# EAGLE design ATTinyRec (EAGLE 7.1.0)
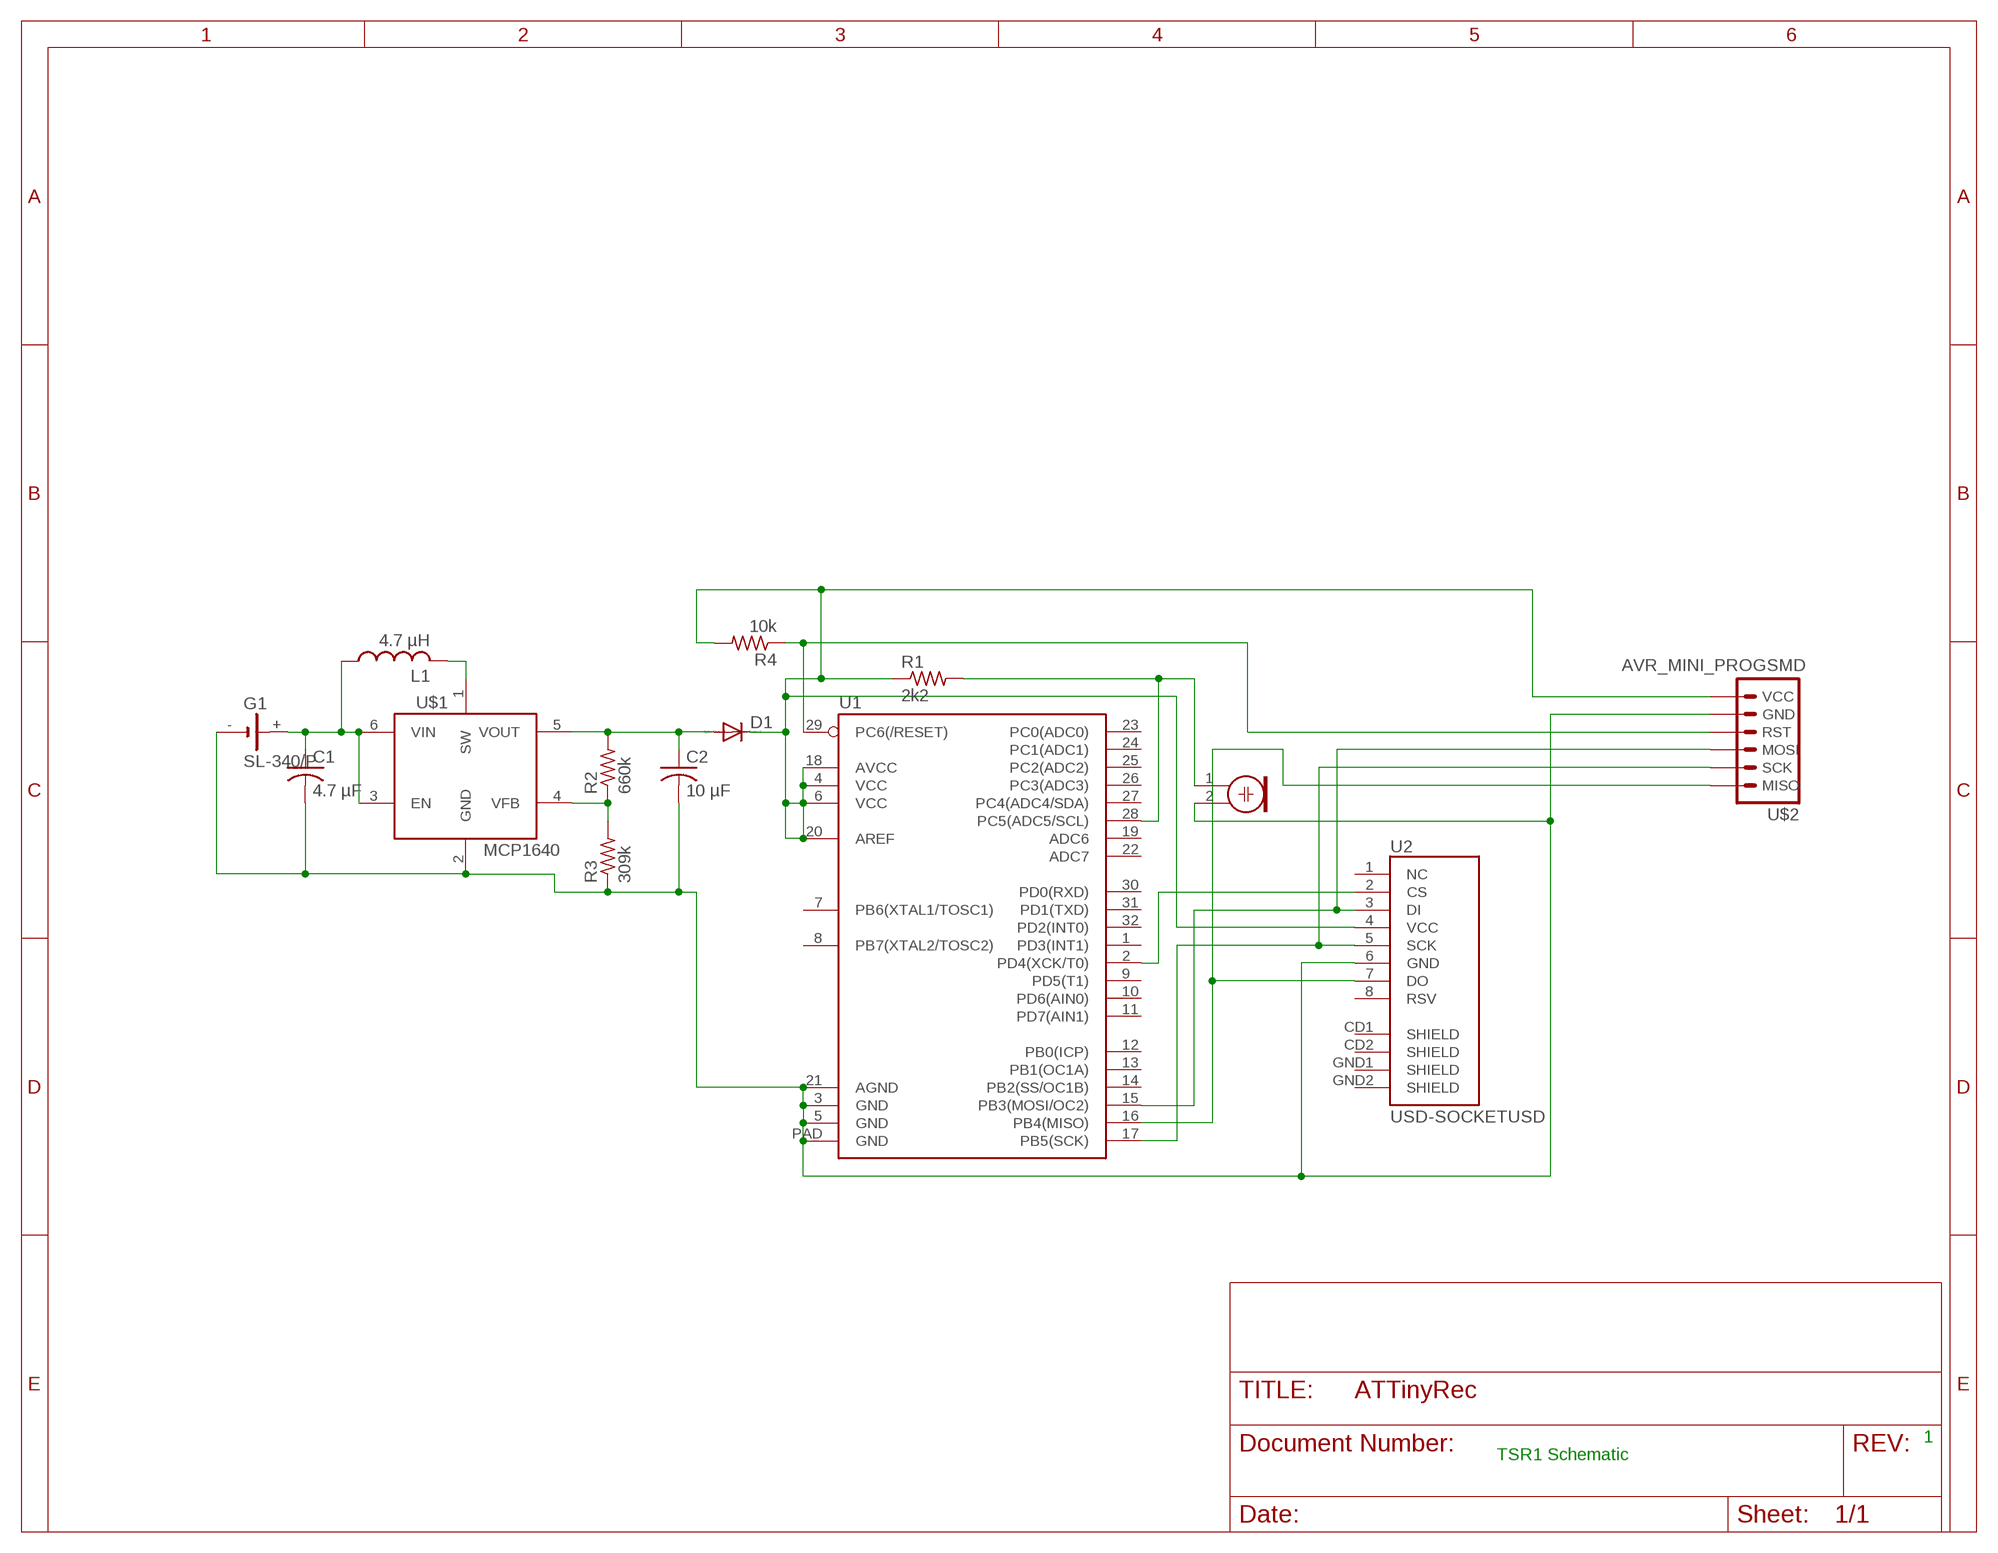
[diagram p0: schematic, sheet 1]

## Parts
C1  4.7 µF  C-USC0402  [C0402]
C2  10 µF  C-USC0402  [C0402]
D1  DIODE-DO214AC  [DO214AC]
G1  SL-340/P  [BEL/P]
L1  4.7 µH  L-USL2012C  [L2012C]
M1  ELECTRET_MICROPHON-WM-62PC/62PK  [WM-62PC/62PK]
R1  2k2  R-US_R0402  [R0402]
R2  660k  R-US_R0402  [R0402]
R3  309k  R-US_R0402  [R0402]
R4  10k  R-US_R0402  [R0402]
U1  ATMEGA328P_MLFMLF32  [MLF32-PAD]
U2  USD-SOCKETUSD  [USD-SOCKET-PP]
U$1  MCP1640  [SOT23-6]
U$2  AVR_MINI_PROGSMD  [AVR_MINI_PROG]

## Nets
GND: C1.2 C2.2 G1.- M1.2 R3.1 U1.3(GND) U1.5(GND) U1.21(AGND) U1.PAD(GND) U2.6(GND) U$1.2(GND) U$2.2(GND)
MISO: U1.16(PB4(MISO)) U2.7(DO) U$2.6(MISO)
MOSI: U1.15(PB3(MOSI/OC2)) U2.3(DI) U$2.4(MOSI)
N$1: C1.1 G1.+ L1.1 U$1.3(EN) U$1.6(VIN)
N$2: R2.1 R3.2 U$1.4(VFB)
N$3: L1.2 U$1.1(SW)
N$8: M1.1 R1.2 U1.28(PC5(ADC5/SCL))
N$10: C2.1 D1.A R2.2 U$1.5(VOUT)
N$13: U1.2(PD4(XCK/T0)) U2.2(CS)
RESET: R4.1 U1.29(PC6(/RESET)) U$2.3(RST)
SCK: U1.17(PB5(SCK)) U2.5(SCK) U$2.5(SCK)
VCC: D1.C R1.1 R4.2 U1.4(VCC) U1.6(VCC) U1.18(AVCC) U1.20(AREF) U2.4(VCC) U$2.1(VCC)
Unconnected: U1.1(PD3(INT1)) U1.7(PB6(XTAL1/TOSC1)) U1.8(PB7(XTAL2/TOSC2)) U1.9(PD5(T1)) U1.10(PD6(AIN0)) U1.11(PD7(AIN1)) U1.12(PB0(ICP)) U1.13(PB1(OC1A)) U1.14(PB2(SS/OC1B)) U1.19(ADC6) U1.22(ADC7) U1.23(PC0(ADC0)) U1.24(PC1(ADC1)) U1.25(PC2(ADC2)) U1.26(PC3(ADC3)) U1.27(PC4(ADC4/SDA)) U1.30(PD0(RXD)) U1.31(PD1(TXD)) U1.32(PD2(INT0)) U2.1(NC) U2.8(RSV) U2.CD1(SHIELD) U2.CD2(SHIELD) U2.GND1(SHIELD) U2.GND2(SHIELD)

## Notes on the sheet
- 1
- TSR1 Schematic

## Library data of the parts
C1 C2 = rcl:C-US: CAPACITOR, American symbol
D1 = diode:DIODE-: DIODE
G1 = battery:SL-340/P: LI BATTERY Sonnenschein SL-340
L1 = resistor:L-US: INDUCTOR, American symbol
M1 = microphon:ELECTRET_MICROPHON-: Electret Condenser Microphone
R1-R4 = rcl:R-US_: RESISTOR, American symbol
U1 = SparkFun-DigitalIC:ATMEGA328P_MLF: 32-Pin Atmega328 part Commonly used on Arduino compatible boards Available in QFP and QFN packages TQFP is IC-09069 QFN is non-stock
U2 = SparkFun-Connectors:USD-SOCKET: microSD Socket Push-push type uSD socket. Schematic element and footprint production proven. Spark Fun Electronics SKU : PRT-00127. tDoc lines correctly indicate media card edge positions when inserting (unlocked, locked, depressed).
U$1 = GeekAmmo:MCP1640: MCP1640 0.65V Start-up Synchronous Boost Regulator with True Output Disconnect or Input/Output Bypass Option The MCP1640/B/C/D is a compact, high-efficiency, fixed frequency, synchronous step-up DC-DC converter. http://ww1.microchip.com/downloads/en/DeviceDoc/22234B.pdf
U$2 = SparkFun-Connectors:AVR_MINI_PROG: AVR ISP 6-pin inline header

## Net classes
0 default: width 0.003 mm

## Board
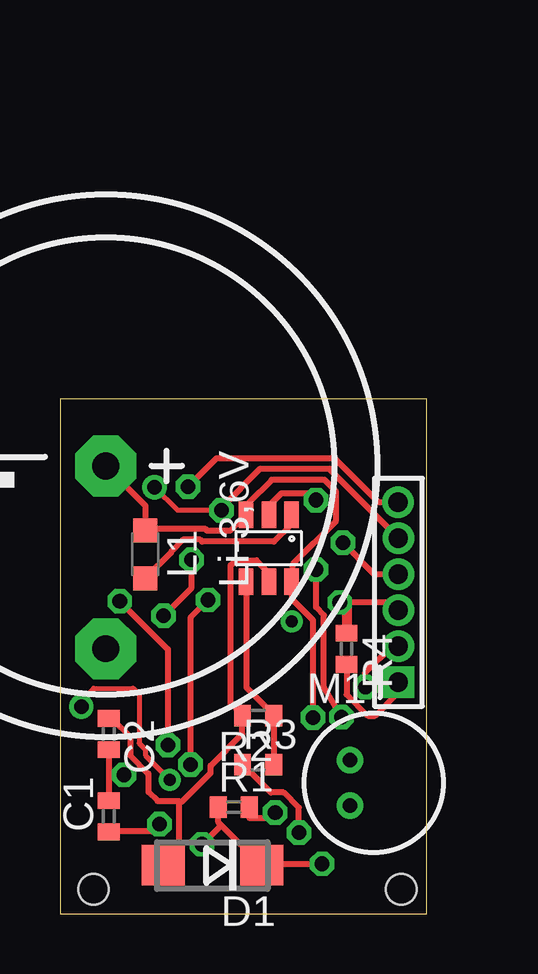
[diagram p1: board, top side]
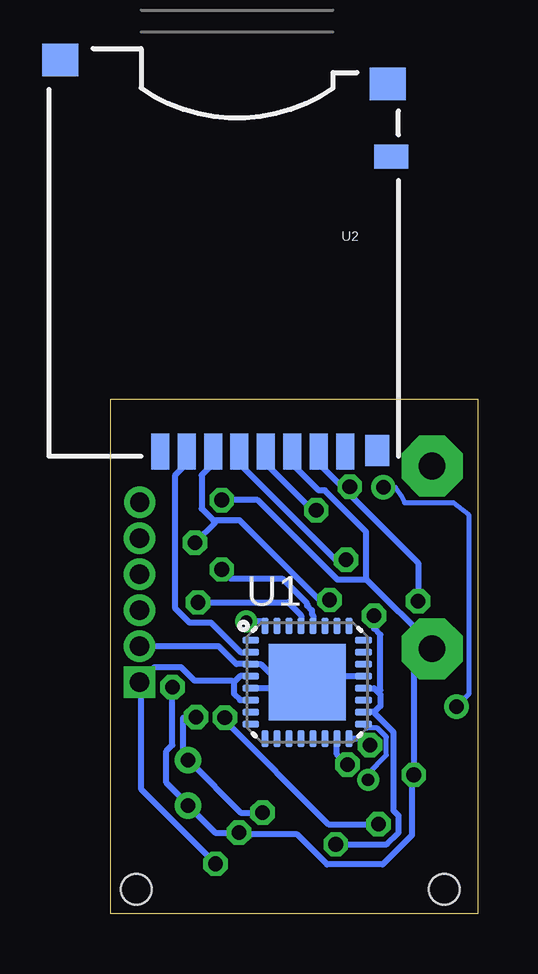
[diagram p2: board, bottom side, seen from below]

Size 15.29 x 21.45 mm. Coordinates in mm from the lower left corner, seen from the top.
Outline: 0,0 15.29,0 15.29,21.45 0,21.45 0,0
Copper layers (1*16): Top 0.035mm / dielectric 1.5mm / Bottom 0.035mm
Design rules "default": minimum track width 10mil, minimum drill 24mil, track to track 8mil, track to pad 8mil, pad to pad 8mil, via to via 8mil, smd to smd 8mil, copper to edge 40mil, drill to drill 8mil, minimum pad ring 10mil, minimum via ring 8mil, stop-mask expansion 4mil, vias tented up to drill 0mil, thermal gap 10mil
Holes 1.27 mm at 1.4,1.02 14.22,1.02

### Footprints (pad centres in the part's own frame; a part is rotated, then mirrored left to right if it is on the bottom)
C0402 = smd 0.7 x 0.9: 1 -0.65,0; 2 0.65,0
DO214AC = smd 1.8 x 1.7: A 2.05,0; C -2.05,0
BEL/P = drill 1.118 pad 2.54 octagon: + 0,0; - -7.62,0
L2012C = smd 1 x 1: 1 -1,0; 2 1,0
WM-62PC/62PK = drill 0.6 pad 1: 1 -1,0.95; 2 -1,-0.95
R0402 = smd 0.7 x 0.9: 1 -0.65,0; 2 0.65,0
MLF32-PAD = smd 0.7 x 0.3: 1 -2.35,1.75; 2 -2.35,1.25; 3 -2.35,0.75; 4 -2.35,0.25; 5 -2.35,-0.25; 6 -2.35,-0.75; 7 -2.35,-1.25; 8 -2.35,-1.75; 17 2.35,-1.75; 18 2.35,-1.25; 19 2.35,-0.75; 20 2.35,-0.25; 21 2.35,0.25; 22 2.35,0.75; 23 2.35,1.25; 24 2.35,1.75 | smd 0.3 x 0.7: 9 -1.75,-2.35; 10 -1.25,-2.35; 11 -0.75,-2.35; 12 -0.25,-2.35; 13 0.25,-2.35; 14 0.75,-2.35; 15 1.25,-2.35; 16 1.75,-2.35; 25 1.75,2.35; 26 1.25,2.35; 27 0.75,2.35; 28 0.25,2.35; 29 -0.25,2.35; 30 -0.75,2.35; 31 -1.25,2.35; 32 -1.75,2.35 | smd 3.2 x 3.2: PAD 0,0
USD-SOCKET-PP = smd 0.75 x 1.5: 1 3.2,16.8; 2 2.1,16.8; 3 1,16.8; 4 -0.1,16.8; 5 -1.2,16.8; 6 -2.3,16.8; 7 -3.4,16.8; 8 -4.5,16.8 | smd 1 x 1.3: CD1 -5.85,16.75 | smd 1.4 x 1: CD2 -6.425,4.5 | smd 1.5 x 1.35: GND1 -6.275,1.475; GND2 7.375,0.475
SOT23-6 = smd 0.6 x 1.1: 1 0,0; 2 0.95,0; 3 1.9,0; 4 1.9,2.8; 5 0.95,2.8; 6 0,2.8
AVR_MINI_PROG = drill 0.8 pad 1.27 square: 1 0,0 | drill 0.8 pad 1.27: 2 1.5,0; 3 3,0; 4 4.5,0; 5 6,0; 6 7.5,0.01

### Placement (x,y rotation side)
C1  2.03,4.06 90 top
C2  2.03,7.49 270 top
D1  6.35,2.03 180 top
G1  1.91,18.67 90 top
L1  3.56,14.99 270 top
M1  13.08,5.46 0 top
R1  7.24,4.45 0 top
R2  8.25,8.26 180 top
R3  8.25,6.22 0 top
R4  11.94,11.05 270 top
U1  7.11,9.65 0 bottom
U2  10.03,36.07 180 bottom
U$1  9.65,16.64 180 top
U$2  14.1,9.65 90 top

### Tracks (layer width: path | path; a pad name or v marks a point on that pad's centre or on a via)
GND  (via drill 0.61)
  Top 0.254: v9.96,3.38 9.96,4.42 9.32,5.05 8.79,5.05 7.62,6.22 R3.1 | C2.2 2.03,5.79 | 2.03,5.79 C1.2 | v10.67,17.25 10.39,17.53 9.22,17.53 8.71,17.02 U$1.2 | v2.67,5.79 2.03,5.79 | v12.72,9.45 12.72,10.06 13.82,11.15 U$2.2
  Bottom 0.254: U1.PAD 6.86,9.91 4.78,9.91 U1.21 | U1.5 9.45,9.4 7.39,9.4 7.21,9.58 U1.PAD | U1.PAD 8.13,9.5 9.02,10.39 9.45,10.39 U1.3 9.58,10.41 10.06,10.41 10.79,11.15 U$2.2 | v10.67,17.25 9.17,17.25 5.84,13.92 4.65,13.92 | 4.65,13.92 4.62,13.92 1.91,11.2 G1.- 1.98,10.95 2.67,10.26 v2.67,5.79 2.74,5.69 2.74,3.28 3.96,2.06 6.27,2.06 7.52,3.3 9.86,3.3 v9.96,3.38 10.95,3.38 12.06,4.5 M1.2 12.14,4.62 12.98,5.46 12.98,6.78 12.72,7.04 v12.72,9.45 | 4.65,13.92 4.65,15.93 6.38,17.65 6.63,17.65 7.72,18.75 7.72,19.25 U2.6
MISO  (via drill 0.61)
  Top 0.254: v4.5,7.04 4.5,11.02 v2.49,13.03 | v5.33,17.8 6.53,19 11.43,19 13.26,17.17 14.07,17.17 U$2.6
  Bottom 0.254: v4.5,7.04 4.75,7.29 U1.16 | v2.49,13.03 2.49,14.63 5.5,17.64 | 5.5,17.64 6.63,18.77 6.63,19.25 U2.7 | v5.33,17.8 5.5,17.64
MOSI  (via drill 0.61)
  Top 0.254: v5.44,6.22 5.44,12.34 v6.17,13.08 | v11.79,15.47 13.08,14.17 14.1,14.17 U$2.4
  Bottom 0.254: v5.44,6.22 5.87,6.66 U1.15 | v6.17,13.08 6.6,13.08 9.93,16.41 10.95,16.41 | 10.95,16.41 11.02,16.41 11.51,16.89 11.51,18.29 11.05,18.75 11.05,19.25 U2.3 | v11.79,15.47 10.95,16.31 10.95,16.41
N$1  (via drill 0.61)
  Top 0.254: G1.+ 3.56,17.02 L1.1 3.66,16.05 6.04,16.05 6.12,15.98 7.09,15.98 U$1.3 7.82,16.74 7.82,17.09 8.81,18.09 11.02,18.09 11.51,17.6 11.51,16.38 9.7,14.58 9.7,13.95 U$1.6 9.65,13.13 10.54,12.24 v10.54,8.18 | v4.14,3.73 3.83,3.43 2.03,3.43 C1.1
  Bottom 0.254: v4.14,3.73 6.22,3.73 10.54,8.05 v10.54,8.18
N$2
  Top 0.254: R3.2 8.92,6.22 8.92,8.26 R2.1 8.84,8.36 7.77,9.42 7.77,13.82 U$1.4
N$3
  Top 0.254: U$1.1 9.65,16.26 8.92,15.52 5.92,15.52 5.84,15.6 5.13,15.6 4.65,15.11 4.65,15.09 L1.2
N$4  (via drill 0.5 pad 0.25)
  other vias: 9.65,12.19
N$5
  Bottom 0.254: 8.89,12.19 9.27,12.19
N$8  (via drill 0.61)
  Top 0.254: v10.67,14.35 10.67,12.78 11,12.45 11,9.45 v11.73,8.2 | v8.97,4.22 8.74,3.99 7.9,3.99 R1.2
  Bottom 0.254: v10.67,14.35 10.29,13.97 8.15,13.97 7.11,12.93 7.11,12.85 6.91,12.65 6.91,12.5 6.86,12.45 6.86,12.01 U1.28 | v11.73,8.2 12.27,8.18 12.27,6.6 12.09,6.43 M1.1 11.99,6.33 9.88,4.22 v8.97,4.22
N$10
  Top 0.254: 4.98,4.67 4.98,2.69 4.32,2.03 D1.A | C2.1 2.03,8.13 2.16,8.13 2.92,7.37 2.92,6.6 3.68,5.84 3.68,5.08 4.06,4.7 4.95,4.7 4.98,4.67 | 4.98,4.67 5.08,4.67 6.27,5.87 6.27,6.17 7.6,7.49 R2.2 7.52,8.36 7.11,8.76 7.11,14.53 7.32,14.73 8.18,14.73 8.69,14.22 8.69,13.84 U$1.5
N$13
  Bottom 0.254: U1.2 9.47,10.9 9.88,10.9 11.12,12.14 12.01,12.14 12.62,12.75 12.62,18.26 12.14,18.75 12.14,19.25 U2.2
RESET  (via drill 0.61)
  Top 0.254: v11.66,12.98 13.79,12.98 14.1,12.68 U$2.3
  Top 0.406: v11.66,12.98 11.94,12.98 R4.1
  Bottom 0.254: v11.66,12.98 7.9,12.98 7.37,12.45 7.37,12.01 U1.29
S$1  (via drill 0.6)
  other vias: 3.94,17.78
S$3  (via drill 0.6)
  other vias: 0.89,8.64
S$5  (via drill 0.51 pad 0.25)
  other vias: 4.57,5.59
SCK  (via drill 0.51 pad 0.25, 0.6, 0.61)
  Top 0.203: v6.73,16.82 4.9,16.82 v3.94,17.78 | v0.89,8.64 0.89,8.89 1.4,9.4 3.05,9.4 3.3,9.14 3.3,7.11 3.56,6.86 3.56,6.6 v4.57,5.59
  Top 0.254: v6.73,16.82 6.73,16.94 8.33,18.54 11.23,18.54 14.1,15.67 U$2.5
  Bottom 0.203: v3.94,17.78 3.43,17.78 3.17,17.4 3.05,17.14 1.02,17.14 0.38,16.64 0.38,9.14 v0.89,8.64 | v4.57,5.59 4.57,5.84 3.81,6.6 3.81,7.37 4.19,7.75 4.61,7.75 U1.17
  Bottom 0.254: v6.73,16.82 6.88,16.82 8.81,18.75 8.81,19.25 U2.5
VCC  (via drill 0.61)
  Top 0.254: 6.72,3.7 8.38,2.03 D1.C 8.51,2.08 v10.92,2.08 | 6.72,3.7 6.6,3.81 6.6,4.45 R1.1 | 6.72,3.7 v5.92,2.9 | v5.49,14.76 5.49,13.59 v4.32,12.42 | R4.2 11.94,9.14 12.83,8.26 13.13,8.26 14.02,9.14 14.02,9.58 U$2.1
  Bottom 0.254: 10.16,9.65 10.16,9.17 9.91,8.91 9.47,8.91 U1.6 | 10.16,9.65 9.91,9.91 9.47,9.91 U1.4 | 10.16,9.65 10.26,9.73 11.81,9.73 12.37,10.29 13.46,10.29 U$2.1 14.02,9.55 14.02,5.18 v10.92,2.08 | 4.32,8.41 U1.18 | 4.32,8.41 4.06,8.66 4.06,9.14 4.15,9.23 | 4.15,9.23 4.32,9.4 U1.20 | v5.92,2.9 3.79,2.9 3.3,3.38 3.3,4.09 3.5,4.29 3.5,7.57 4.24,8.31 4.32,8.41 | v5.49,14.76 5.92,14.76 9.93,18.77 9.93,19.25 U2.4 | v4.32,12.42 4.32,11.89 4.06,11.63 4.06,9.32 4.15,9.23